# EAGLE design ch340_usb (EAGLE 9.6.2)
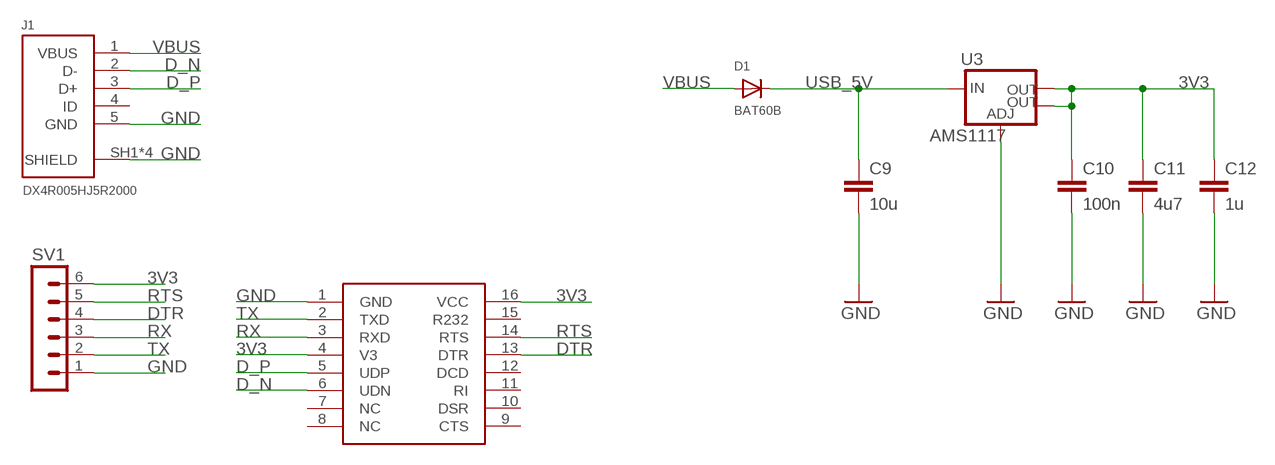
[diagram p0: schematic, sheet 1]

## Parts
C9  10u  C-EUC0603  [C0603]
C10  100n  C-EUC0603  [C0603]
C11  4u7  C-EUC0603  [C0603]
C12  1u  C-EUC0603  [C0603]
D1  BAT60B  DIODESOD-323F  [SOD-323F]
J1  DX4R005HJ5R2000  [DX4R005HJ5R2000]
SV1  MA06-1  [MA06-1]
U3  AMS1117  V_REG_LM1117SOT223  [SOT223]
U$1  CH340  [SOP16]

## Nets
3V3: C10.1 C11.1 C12.1 SV1.6 U3.2(OUT) U3.4(OUT) U$1.4(V3) U$1.16(VCC)
D_N [usb]: J1.2(D-) U$1.6(UDN)
D_P [usb]: J1.3(D+) U$1.5(UDP)
DTR: SV1.4 U$1.13(DTR)
GND: C9.2 C10.2 C11.2 C12.2 J1.5(GND) J1.SH1(SHIELD) J1.SH2(SHIELD) J1.SH3(SHIELD) J1.SH4(SHIELD) SV1.1 U3.1(ADJ) U$1.1(GND)
RTS: SV1.5 U$1.14(RTS)
RX: SV1.3 U$1.3(RXD)
TX: SV1.2 U$1.2(TXD)
USB_5V: C9.1 D1.C U3.3(IN)
VBUS: D1.A J1.1(VBUS)
Unconnected: J1.4(ID) U$1.7(NC) U$1.8(NC) U$1.9(CTS) U$1.10(DSR) U$1.11(RI) U$1.12(DCD) U$1.15(R232)

## Library data of the parts
C9-C12 = rcl:C-EU: CAPACITOR, European symbol; SPICEPREFIX: C
D1 = adafruit:DIODE: Diode SMADIODE - SMA Surface Mount Package 20V 1A Schottky Diode Digikey: 641-1014-6-ND DO-1N4148 - Through Hole Small Current Diode SOD-123 20V 1 A (.5mV Vf) Schottky Diode - Digikey: MBRX120TPMSCT-ND SOD-323 10V 570mA (.38mV Vf, 3ns) Schottky Diode - Digikey: ZLLS410CT-ND SOD-523 30V 30mA Schottky Diode (RB751S-40TE61) - Digikey: RB751S-40TE61CT-ND SOT23-R/W - SOT23 Package (R = Solder Paste/Reflow Ovens, W = Hand-Soldering) BAT54Film 40V 300mA - Digikey: 497-7162-1-ND
J1 = USB connector:DX4R005HJ5R2000: CONN RCPT USB2.0 MICRO B SMD R/A Manufacturer's datasheet <https://www.jae.com/direct/topics/topics_file_download/topics_id=64360&ext_no=08&_lang=en>; CREATED_BY: PCBLayout.com; DIGIKEY_PARTNO: 670-2674-2-ND; MANUFACTURER: JAE Electronics; MPN: DX4R005HJ5R2000
SV1 = con-lstb:MA06-1: PIN HEADER; OC_FARNELL: unknown; OC_NEWARK: unknown
U3 = SparkFun-IC-Power:V_REG_LM1117: Voltage Regulator LM1117 Standard adjustable voltage regulator but in SMD form. Spark Fun Electronics SKU : COM-00595; PROD_ID: VREG-08170
U$1 = ch340:CH340

## Net classes
0 default: width 0.254 mm, clearance 0.254 mm
1 usb: width 0.254 mm, clearance 0.203 mm

## Board
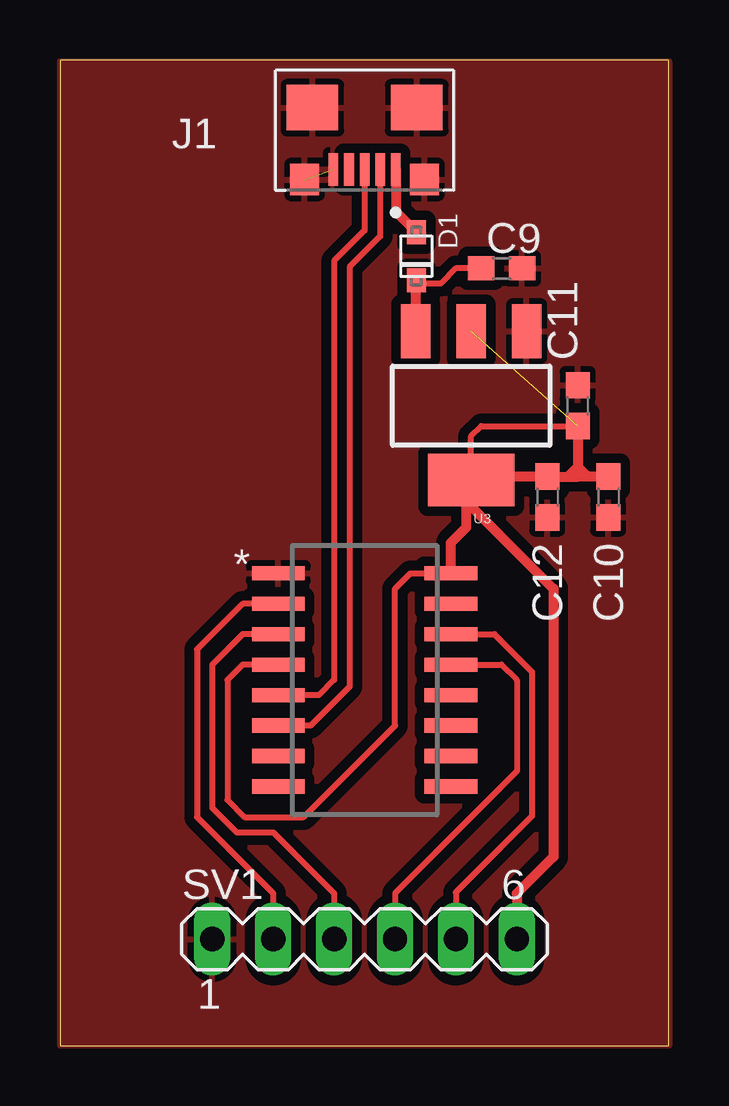
[diagram p1: board, top side]

Size 25.38 x 41.07 mm. Coordinates in mm from the lower left corner, seen from the top.
Outline: 0,0 25.38,0 25.38,41.07 0,41.07 0,0
Copper layers (1*16): Top 0.035mm / dielectric 1.5mm / Bottom 0.035mm
Design rules "default *": minimum track width 6mil, minimum drill 0.35mm, track to track 6mil, track to pad 6mil, pad to pad 6mil, via to via 6mil, smd to smd 6mil, copper to edge 0mil, drill to drill 6mil, minimum pad ring 10mil, minimum via ring 8mil, stop-mask expansion 4mil, vias tented up to drill 0mil, thermal gap 10mil

### Footprints (pad centres in the part's own frame; a part is rotated, then mirrored left to right if it is on the bottom)
C0603 = smd 1.1 x 1: 1 -0.85,0; 2 0.85,0
SOD-323F = smd 1 x 0.8: A -1,0; C 1,0
DX4R005HJ5R2000 = smd 0.4 x 1.35: 1 -1.3,4.125; 2 -0.65,4.125; 3 0,4.125; 4 0.65,4.125; 5 1.3,4.125 | smd 1.2 x 1.3: SH1 -2.5,4.55; SH2 2.5,4.55 | smd 2.15 x 1.9: SH3 -2.175,1.55; SH4 2.175,1.55
MA06-1 = drill 1.016 long: 1 -6.35,0; 2 -3.81,0; 3 -1.27,0; 4 1.27,0; 5 3.81,0; 6 6.35,0
SOT223 = smd 1.219 x 2.235: 1 -2.311,-3.099; 2 0,-3.099; 3 2.311,-3.099 | smd 3.6 x 2.2: 4 0,3.099
SOP16 = smd 2.2 x 0.6: 1 -3.6,4.445; 2 -3.6,3.175; 3 -3.6,1.905; 4 -3.6,0.635; 5 -3.6,-0.635; 6 -3.6,-1.905; 7 -3.6,-3.175; 8 -3.6,-4.445; 9 3.6,-4.445; 10 3.6,-3.175; 11 3.6,-1.905; 12 3.6,-0.635; 13 3.6,0.635; 14 3.6,1.905; 15 3.6,3.175; 16 3.6,4.445

### Placement (x,y rotation side)
C9  18.41,32.38 0 top
C10  22.86,22.86 270 top
C11  21.59,26.67 90 top
C12  20.32,22.86 270 top
D1  14.86,32.89 270 top
J1  12.7,40.64 180 top
SV1  12.7,4.45 0 top
U3  17.14,26.67 180 top
U$1  12.7,15.24 0 top

### Tracks (layer width: path | path; a pad name or v marks a point on that pad's centre or on a via)
3V3  (1 unrouted)
  Top 0.254: U$1.4 7.62,15.88 6.99,15.24 6.99,10.24 7.7,9.53 10.16,9.53 13.97,13.34 13.97,19.05 14.61,19.68 U$1.16 | U3.4 17.14,25.4 17.57,25.82 C11.1
  Top 0.406: U3.4 16.93,23.36 16.93,21.59 16.3,20.95 U$1.16 | U3.4 17.18,23.53 17.36,23.71 C12.1 21.17,23.71 | C10.1 22.01,23.71 | 22.01,23.71 21.59,23.71 | 21.17,23.71 21.59,23.71 | C11.1 21.59,24.13 | 21.59,23.71 21.59,24.13 | 21.59,24.13 22.01,23.71 | 21.17,23.71 21.59,24.13 | U3.4 17.14,22.48 20.57,19.05 20.57,7.87 19.05,6.35 SV1.6
D_N
  Top 0.254: U$1.6 10.45,13.34 12.08,14.96 12.08,32.45 13.35,33.72 J1.2
D_P
  Top 0.254: U$1.5 10.79,14.61 11.43,15.24 11.43,32.7 12.7,33.98 J1.3
DTR
  Top 0.254: U$1.13 18.41,15.88 19.05,15.24 19.05,11.43 13.97,6.35 SV1.4
GND  (1 unrouted)
  pour Top (isolate 0.406): 0,0 0,41.02 25.4,41.02 25.4,0
RTS
  Top 0.254: U$1.14 18.12,17.14 19.68,15.58 19.68,9.57 16.51,6.39 SV1.5
RX
  Top 0.254: U$1.3 7.62,17.14 6.35,15.88 6.35,9.91 7.37,8.89 8.89,8.89 11.43,6.35 SV1.3
TX
  Top 0.254: U$1.2 7.62,18.41 5.71,16.51 5.71,9.53 8.89,6.35 SV1.2
USB_5V
  Top 0.254: C9.1 16.51,32.38 15.88,31.75 14.83,31.75
  Top 0.406: U3.3 14.83,31.75 14.83,31.87 D1.C
VBUS
  Top 0.406: J1.1 14,34.75 D1.A